# Altium schematic sheet Power.SchDoc: Power
size A4; CompanyName: SpaceBee Technologies; Organization: Open Space; Address1: Argentina; DocumentNumber: 1; Revision: 0; SheetNumber: 6; SheetTotal: 6; Proyect: Rovertito; Mail: mgmt@spacebeetech.com
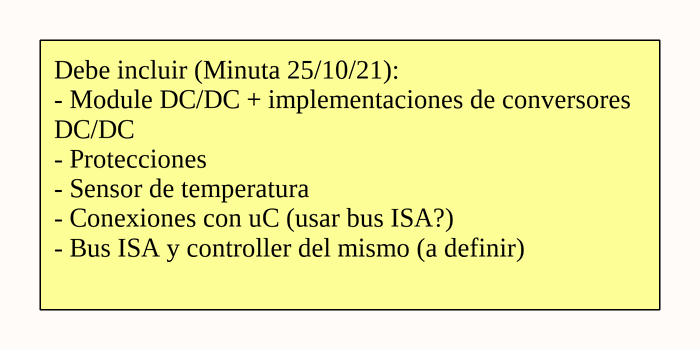
[diagram p0: Power.SchDoc]

## Notes on the sheet
- Debe incluir (Minuta 25/10/21):
  - Module DC/DC + implementaciones de conversores DC/DC
  - Protecciones
  - Sensor de temperatura
  - Conexiones con uC (usar bus ISA?)
  - Bus ISA y controller del mismo (a definir)
- Title
- Board:
- File:
- Authors
- M. Armanasco
- S. Nuñez
- M. Vagalao
- Proyect:
- Date:
- Mail:
- Size:
- Sheet
- A4
- of
- Organization:
- Revision:
- S. Rodriguez
- S. Leguizamon
- J. Alvarez
- and